# EAGLE design MicroMod_Environmental (EAGLE 9.5.1)
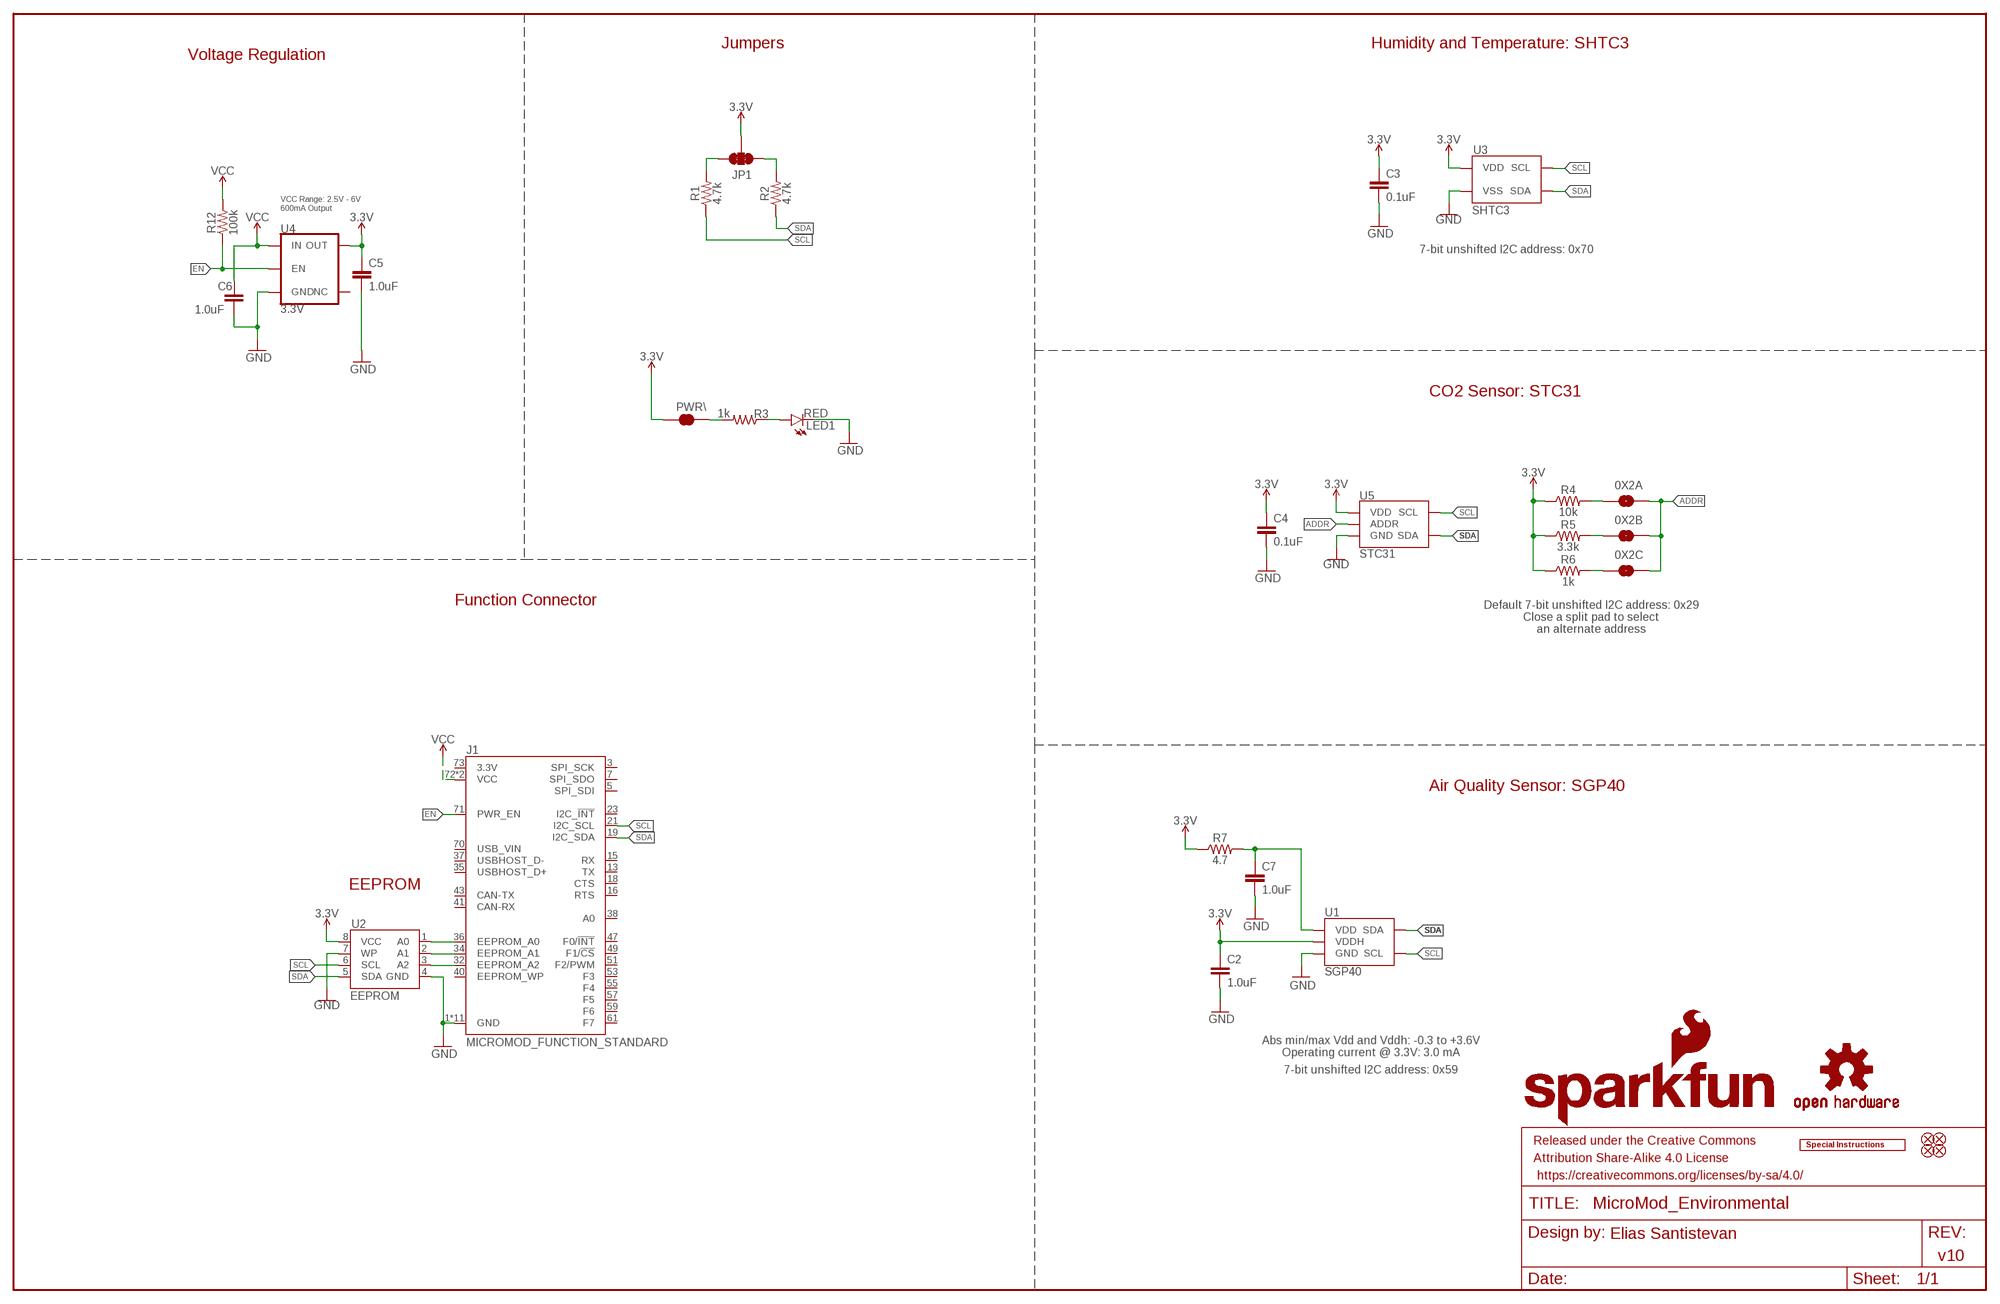
[diagram p0: schematic, sheet 1]

## Parts
0X2A  JUMPER-SMT_2_NO_SILK  [SMT-JUMPER_2_NO_SILK]
0X2B  JUMPER-SMT_2_NO_SILK  [SMT-JUMPER_2_NO_SILK]
0X2C  JUMPER-SMT_2_NO_SILK  [SMT-JUMPER_2_NO_SILK]
C2  1.0uF  1.0UF-0603-16V-10%-X7R  [0603]
C3  0.1uF  0.1UF-0603-25V-5%  [0603]
C4  0.1uF  0.1UF-0603-25V-5%  [0603]
C5  1.0uF  1.0UF-0603-16V-10%  [0603]
C6  1.0uF  1.0UF-0603-16V-10%  [0603]
C7  1.0uF  1.0UF-0603-16V-10%-X7R  [0603]
FD1  FIDUCIAL1X2  [FIDUCIAL-1X2]
FD2  FIDUCIAL1X2  [FIDUCIAL-1X2]
FD3  FIDUCIAL1X2  [FIDUCIAL-1X2]
FD4  FIDUCIAL1X2  [FIDUCIAL-1X2]
FRAME1  FRAME-LEDGER  [CREATIVE_COMMONS]
J1  MICROMOD_FUNCTION_STANDARD  [M.2-CARD-E-22_FUNCTION_STANDARD]
JP1  JUMPER-SMT_3_2-NC_TRACE_SILK  [SMT-JUMPER_3_2-NC_TRACE_SILK]
LED1  RED  LED-RED0603  [LED-0603]
LOGO1  SFE_LOGO_NAME_FLAME.2_INCH  [SFE_LOGO_NAME_FLAME_.2]
LOGO2  OSHW-LOGOS  [OSHW-LOGO-S]
LOGO3  SPECIAL_INSTRUCTIONS-ORDERING  [ORDERING_INSTRUCTIONS]
PWR\  JUMPER-SMT_2_NC_TRACE_SILK  [SMT-JUMPER_2_NC_TRACE_SILK]
R1  4.7k  4.7KOHM-0603-1/10W-1%  [0603]
R2  4.7k  4.7KOHM-0603-1/10W-1%  [0603]
R3  1k  1KOHM-0603-1/10W-1%  [0603]
R4  10k  10KOHM-0603-1/10W-1%  [0603]
R5  3.3k  3.3KOHM-0603-1/10W-1%  [0603]
R6  1k  1KOHM-0603-1/10W-1%  [0603]
R7  4.7  4.7OHM-0603-1/10W-1%  [0603]
R12  100k  100KOHM-0603-1/10W-1%  [0603]
U1  SGP40  [SGP40]
U2  EEPROM  EEPROM-I2C512K  [SO08]
U3  SHTC3  [SHTC3]
U4  3.3V  V_REG_AP2112K-3.3V  [SOT23-5]
U5  STC31  [STC31]

## Nets
3.3V [Diff pairs]: C2.1 C3.1 C4.1 C5.1 JP1.2 PWR\.2 R4.1 R5.1 R6.1 R7.1 U1.5(VDDH) U2.8(VCC) U3.1(VDD) U4.5(OUT) U5.6(VDD)
A0: J1.36(EEPROM_A0) U2.1(A0)
A1: J1.34(EEPROM_A1) U2.2(A1)
A2: J1.32(EEPROM_A2) U2.3(A2)
ADDR: 0X2A.2 0X2B.2 0X2C.2 U5.3(ADDR)
EN: J1.71(PWR_EN) R12.1 U4.3(EN)
GND: C2.2 C3.2 C4.2 C5.2 C6.2 C7.2 J1.1(GND) J1.33(GND) J1.39(GND) J1.45(GND) J1.75(GND) J1.GND1(GND) J1.GND2(GND) J1.GND3(GND) J1.GND4(GND) J1.GND5(GND) J1.GND6(GND) LED1.C U1.2(GND) U1.4(GND) U1.DIEPAD(GND) U2.4(GND) U2.7(WP) U3.4(VSS) U3.5(VSS) U4.2(GND) U5.1(GND) U5.5(GND) U5.9(GND) U5.11(GND) U5.DIEPAD(GND)
N$1: PWR\.1 R3.2
N$2: C7.1 R7.2 U1.1(VDD)
N$3: JP1.3 R1.2
N$4: JP1.1 R2.2
N$5: 0X2A.1 R4.2
N$6: 0X2B.1 R5.2
N$7: 0X2C.1 R6.2
N$10: LED1.A R3.1
SCL: J1.21(I2C_SCL) R1.1 U1.6(SCL) U2.6(SCL) U3.2(SCL) U5.4(SCL)
SDA: J1.19(I2C_SDA) R2.1 U1.3(SDA) U2.5(SDA) U3.3(SDA) U5.7(SDA)
VCC: C6.1 J1.72(VCC) J1.74(VCC) R12.2 U4.1(IN)
Unconnected: J1.3(SPI_SCK) J1.5(SPI_SDI) J1.7(SPI_SDO) J1.13(TX) J1.15(RX) J1.16(RTS) J1.18(CTS) J1.23(I2C_!INT!) J1.35(USBHOST_D+) J1.37(USBHOST_D-) J1.38(A0) J1.40(EEPROM_WP) J1.41(CAN-RX) J1.43(CAN-TX) J1.47(F0/!INT!) J1.49(F1/!CS!) J1.51(F2/PWM) J1.53(F3) J1.55(F4) J1.57(F5) J1.59(F6) J1.61(F7) J1.70(USB_VIN) J1.73(3.3V) U4.4(NC)

## Notes on the sheet
- Jumpers | Humidity and Temperature: SHTC3
- Voltage Regulation
- VCC Range: 2.5V - 6V 
  600mA Output
- 7-bit unshifted I2C address: 0x70
- CO2 Sensor: STC31
- Function Connector
- Default 7-bit unshifted I2C address: 0x29
  Close a split pad to select
  an alternate address
- Air Quality Sensor: SGP40
- EEPROM
- Abs min/max Vdd and Vddh: -0.3 to +3.6V
  Operating current @ 3.3V: 3.0 mA
- 7-bit unshifted I2C address: 0x59
- Elias Santistevan
- v10

## Library data of the parts
0X2A 0X2B 0X2C = SparkFun-Jumpers:JUMPER-SMT_2_NO: Normally open jumper This jumper has two pads in close proximity to each other. Apply solder to close the connection. Round pads are easier to solder for beginners, but are a lot larger. SparkFun Product that uses the round pads: SparkFun EL Sequencer <https://www.sparkfun.com/products/12781>
C2 C7 = SparkFun-Capacitors:1.0UF: 1µF ceramic capacitors A capacitor is a passive two-terminal electrical component used to store electrical energy temporarily in an electric field.; PROD_ID: CAP-13930
C3 C4 = SparkFun-Capacitors:0.1UF: 0.1µF ceramic capacitors A capacitor is a passive two-terminal electrical component used to store electrical energy temporarily in an electric field.; PROD_ID: CAP-08604
C5 C6 = SparkFun-Capacitors:1.0UF: 1µF ceramic capacitors A capacitor is a passive two-terminal electrical component used to store electrical energy temporarily in an electric field.; PROD_ID: CAP-00868
FD1-FD4 = SparkFun-Aesthetics:FIDUCIAL: Fiducial Alignment Points Point-of-reference for pick-and-place machines and other optical instruments.
FRAME1 = SparkFun-Aesthetics:FRAME-LEDGER: Schematic Frame - Ledger Standard 11x14 US Ledger frame
J1 = SparkFun-MicroMod:MICROMOD_FUNCTION: MicroMod Connector Description: A card edge connector and mating PCB connector to allow various MicroMod Processor Boards to be coupled with various carrier boards of different capabilities. Based on the M.2 standard.
JP1 = SparkFun-Jumpers:JUMPER-SMT_3_2-NC_TRACE: Normally closed trace jumper (2 of 2 connections) This jumper has a trace between all three pads so they are normally closed (NC). Use a razor knife to open the connection(s). For best results follow the IPC guidelines for cutting traces: Cutout at least 0.063 mm (0.005 in). Remove all loose material to clean up the cut area. Seal the cut with an approved epoxy. Reapply solder to reclose the connection(s).
LED1 = SparkFun-LED:LED-RED: Red SMD LED Used in manufacturing of most products at SparkFun Packages: 0603 - SMD 0603 package [Product Link] <http://docs.avagotech.com/docs/AV02-0551EN> 0603 SMART - SMD 0603 SMART package ( more efficient and expensive)[Product Link] <http://www.osram-os.com/Graphics/XPic2/00077099_0.pdf> 1206 - SMD1206 package [Product Link] <https://www.sparkfun.com/datasheets/DevTools/LilyPad/Q150OVS4.pdff> SparkFun Products: Pro Mini 328 -5V <https://www.sparkfun.com/products/821> RedBoard <https://www.sparkfun.com/products/12757> IOIO-OTG <https://www.sparkfun.com/products/13613>; PROD_ID: DIO-00819
LOGO1 = SparkFun-Aesthetics:SFE_LOGO_NAME_FLAME: SparkFun Font Logo w/ Flame This is the SparkFun full logo. The logo on the schematic will always be the same size; the package variant is the height of the flame part of the logo. Default layer for the logo on the board is tSilk.
LOGO2 = SparkFun-Aesthetics:OSHW-LOGO: Open-Source Hardware (OSHW) Logo This logo indicates the piece of hardware it is found on incorporates a OSHW license and/or adheres to the definition of open source hardware found here: http://freedomdefined.org/OSHW
LOGO3 = SparkFun-Aesthetics:SPECIAL_INSTRUCTIONS: Special Ordering/Production Instructions Alert Symbol for special PCB ordering instructions or unique production process warnings. Ordering Instructions Production Instructions Types of information that should be added to box: Copper weight Soldermask color Silk color PCB thickness Number of layers PCB Standard: 1.6mm FR4 1 oz copper immersion silver plating red soldermask white silkscreen Types of information that should be added to box: Special wash requirements Depaneling instructions Humidification Glue curing Default text settings: 0.07 inch 9% ratio 50% line distance
PWR\ = SparkFun-Jumpers:JUMPER-SMT_2_NC_TRACE: Normally closed trace jumper This jumper has a trace between two pads so it's normally closed (NC). Use a razor knife to open the connection. For best results follow the IPC guidelines for cutting traces: Cutout at least 0.063 mm (0.005 in). Remove all loose material to clean up the cut area. Seal the cut with an approved epoxy. Reapply solder to reclose the connection.
R1 R2 = SparkFun-Resistors:4.7KOHM: 4.7kΩ resistor A resistor is a passive two-terminal electrical component that implements electrical resistance as a circuit element. Resistors act to reduce current flow, and, at the same time, act to lower voltage levels within circuits. - Wikipedia; PROD_ID: RES-07857
R3 R6 = SparkFun-Resistors:1KOHM: 1kΩ resistor A resistor is a passive two-terminal electrical component that implements electrical resistance as a circuit element. Resistors act to reduce current flow, and, at the same time, act to lower voltage levels within circuits. - Wikipedia; PROD_ID: RES-07856
R4 = SparkFun-Resistors:10KOHM: 10kΩ resistor A resistor is a passive two-terminal electrical component that implements electrical resistance as a circuit element. Resistors act to reduce current flow, and, at the same time, act to lower voltage levels within circuits. - Wikipedia; PROD_ID: RES-00824
R5 = SparkFun-Resistors:3.3KOHM: 3.3kΩ resistor A resistor is a passive two-terminal electrical component that implements electrical resistance as a circuit element. Resistors act to reduce current flow, and, at the same time, act to lower voltage levels within circuits. - Wikipedia; PROD_ID: RES-07851
R7 = SparkFun-Resistors:4.7OHM: 4.7Ω resistor A resistor is a passive two-terminal electrical component that implements electrical resistance as a circuit element. Resistors act to reduce current flow, and, at the same time, act to lower voltage levels within circuits. - Wikipedia; PROD_ID: RES-15581
R12 = SparkFun-Resistors:100KOHM: 100kΩ resistor A resistor is a passive two-terminal electrical component that implements electrical resistance as a circuit element. Resistors act to reduce current flow, and, at the same time, act to lower voltage levels within circuits. - Wikipedia; PROD_ID: RES-07828
U1 = SparkFun-Sensors:SGP40: The SGP40 is a digital gas sensor designed for easy integration into air purifiers or demand-controlled ventilation systems.; DIGIKEY_PART: 1649-SGP40-D-R4CT-ND; PROD_ID: IC-15580
U2 = SparkFun-IC-Memory:EEPROM-I2C: I2C EEPROMs, 24LC256 and others 24LC256 Series 256 kb I2C 2 Wire (32 k x 8 Bit) 2.5 V Serial EEPROM SMD - SOIC-8 Datasheet SparkFun Products SparkFun UDB5 - PIC UAV Development Board <https://www.sparkfun.com/products/11703> (GPS-11703); PROD_ID: IC-14645
U3 = SparkFun-Sensors:SHTC3: Sensirion SHTC3 Humidity Sensor The SHTC3 is a digital humidity and temperature sensor designed especially for battery-driven high-volume consumer electronics applications.; PROD_ID: IC-14840
U4 = SparkFun-IC-Power:V_REG_AP2112: AP2112 - 600mA CMOS LDO Regulator w/ Enable The AP2112 is CMOS process low dropout linear regulator with enable function, the regulator delivers a guaranteed 600mA (min.) continuous load current. Features Output Voltage Accuracy: ±1.5% Output Current: 600mA (Min.) Foldback Short Current Protection: 50mA Enable Function to Turn ON/OFF VOUT Low Dropout Voltage (3.3V): 250mV (Typ.) @IOUT=600mA Excellent Load Regulation: 0.2%/A (Typ.) Excellent Line Regulation: 0.02%/V (Typ.) Low Quiescent Current: 55μA (Typ.) Low Standby Current: 0.01μA (Typ.) Low Output Noise: 50μVRMS PSRR: 100Hz -65dB, 1kHz -65dB OTSD Protection Stable with 1.0μF Flexible Cap: Ceramic, Tantalum and Aluminum Electrolytic Operation Temperature Range: -40°C to 85°C ESD: MM 400V, HBM 4000V; PROD_ID: VREG-12457
U5 = SparkFun-Sensors:STC31: STC31 CO2 Sensor Based on Thermal Conductivity; MANU_PART: STC31-R3; PROD_ID: IC-16076

## Net classes
1 Antenna: width 1 mm, clearance 0.3 mm

## Board
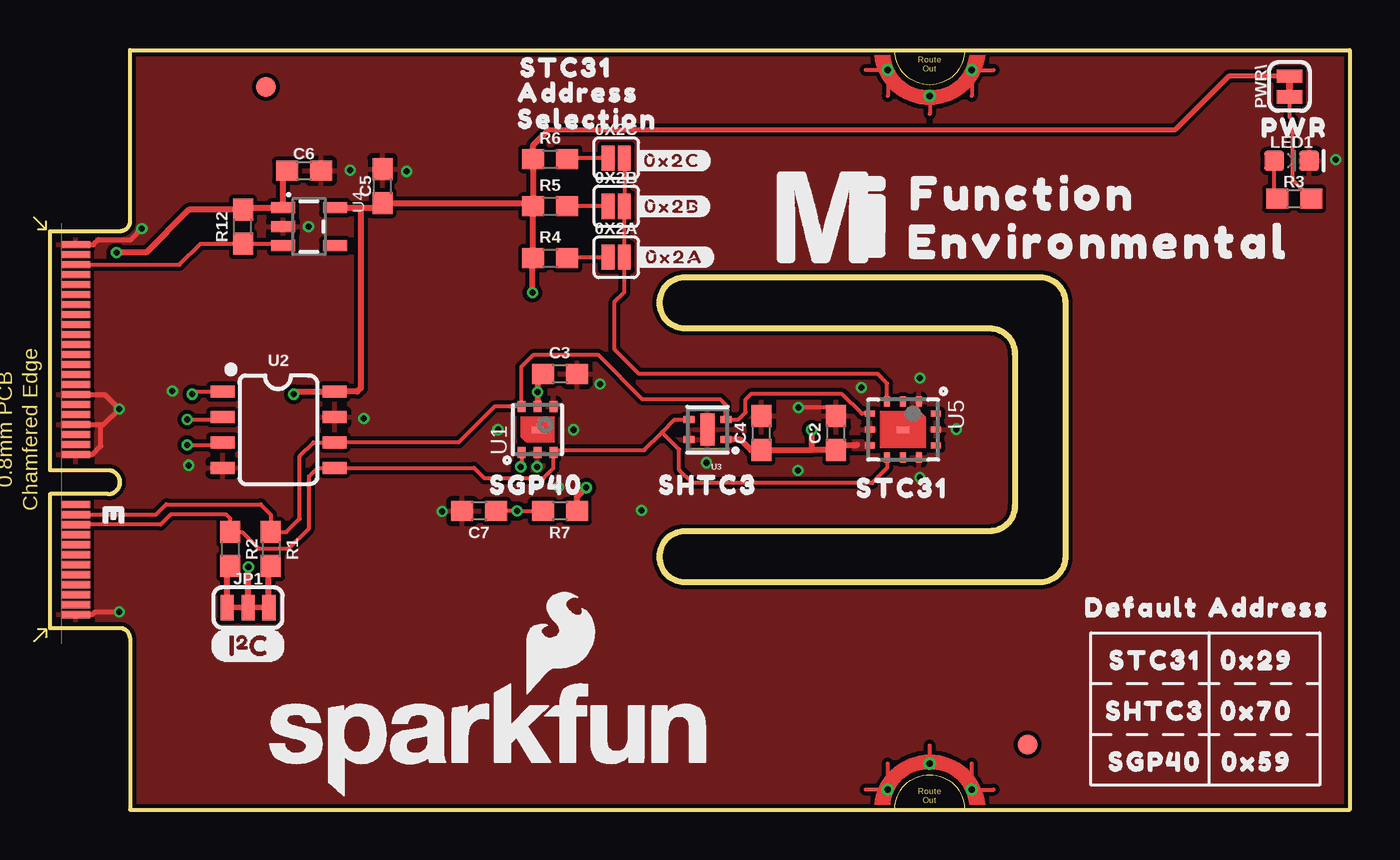
[diagram p1: board, top side]
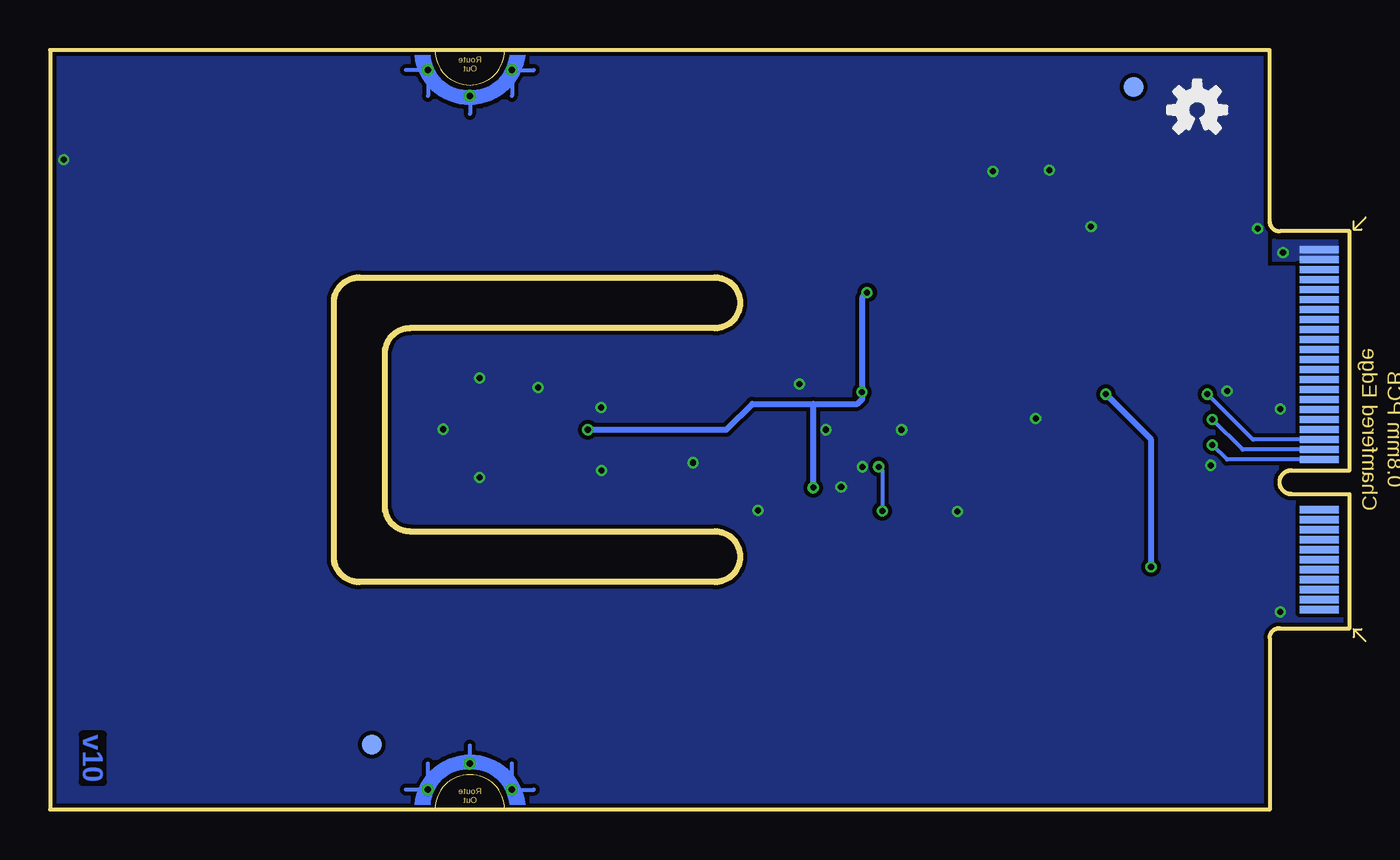
[diagram p2: board, bottom side, seen from below]

Size 65 x 38 mm. Coordinates in mm from the lower left corner, seen from the top.
Outline: 0,9.07 0,15.77 2.9,15.77 arc180 2.9,16.97 0,16.97 0,28.93 3.5,28.93 arc84 4,29.4 4,38 65,38 65,0 4,0 4,8.6 arc85 3.5,9.07 0,9.07
Outline: 30.48,12.65 arc90 31.75,11.38 49.53,11.38 arc90 50.8,12.65 50.8,25.35 arc90 49.53,26.62 31.75,26.62 arc90 30.48,25.35 arc90 31.75,24.08 46.99,24.08 arc-90 48.26,22.81 48.26,15.19 arc-90 46.99,13.92 31.75,13.92 arc90 30.48,12.65
Copper layers (1*16): Top 0.035mm / dielectric 1.5mm / Bottom 0.035mm
Design rules "SparkFun-2-Layer-Minimum-JLCPCB": minimum track width 5mil, minimum drill 0.3mm, track to track 5mil, track to pad 5mil, pad to pad 5mil, via to via 5mil, smd to smd 5mil, copper to edge 7mil, drill to drill 7mil, minimum pad ring 5mil, minimum via ring 5mil, stop-mask expansion 2.5mil, vias tented up to drill 25mil, thermal gap 10mil

### Footprints (pad centres in the part's own frame; a part is rotated, then mirrored left to right if it is on the bottom)
SMT-JUMPER_2_NO_SILK = smd 0.635 x 1.27: 1 -0.406,0; 2 0.406,0
0603 = smd 1.1 x 1: 1 -0.85,0; 2 0.85,0
FIDUCIAL-1X2 = smd 1 x 1: 1 0,0
M.2-CARD-E-22_FUNCTION_STANDARD = smd 0.35 x 1.45: 1 9.25,1.275; 3 8.75,1.275; 5 8.25,1.275; 7 7.75,1.275; 9 7.25,1.275; 11 6.75,1.275; 13 6.25,1.275; 15 5.75,1.275; 17 5.25,1.275; 19 4.75,1.275; 21 4.25,1.275; 23 3.75,1.275; 33 1.25,1.275; 35 0.75,1.275; 37 0.25,1.275; 39 -0.25,1.275; 41 -0.75,1.275; 43 -1.25,1.275; 45 -1.75,1.275; 47 -2.25,1.275; 49 -2.75,1.275; 51 -3.25,1.275; 53 -3.75,1.275; 55 -4.25,1.275; 57 -4.75,1.275; 59 -5.25,1.275; 61 -5.75,1.275; 63 -6.25,1.275; 65 -6.75,1.275; 67 -7.25,1.275; 69 -7.75,1.275; 71 -8.25,1.275; 73 -8.75,1.275; 75 -9.25,1.275 | smd 0.35 x 1.95 bottom: 2 9,1.525; 4 8.5,1.525; 6 8,1.525; 8 7.5,1.525; 10 7,1.525; 12 6.5,1.525; 14 6,1.525; 16 5.5,1.525; 18 5,1.525; 20 4.5,1.525; 22 4,1.525; 32 1.5,1.525; 34 1,1.525; 36 0.5,1.525; 38 0,1.525; 40 -0.5,1.525; 42 -1,1.525; 44 -1.5,1.525; 46 -2,1.525; 48 -2.5,1.525; 50 -3,1.525; 52 -3.5,1.525; 54 -4,1.525; 56 -4.5,1.525; 58 -5,1.525; 60 -5.5,1.525; 62 -6,1.525; 64 -6.5,1.525; 66 -7,1.525; 68 -7.5,1.525; 70 -8,1.525; 72 -8.5,1.525; 74 -9,1.525 | drill 0.305 pad 0.61: GND1 -18,41.9; GND2 -16.7,44; GND3 -18,46.1; GND4 18,41.9; GND5 16.7,44; GND6 18,46.1
SMT-JUMPER_3_2-NC_TRACE_SILK = smd 0.66 x 1.27: 1 -1.041,0; 2 0,0; 3 1.041,0
LED-0603 = smd 1 x 1: A -0.877,0; C 0.877,0
SMT-JUMPER_2_NC_TRACE_SILK = smd 0.66 x 1.27: 1 -0.521,0; 2 0.521,0
SGP40 = smd 0.55 x 0.4: 1 -1.15,0.8; 2 -1.15,0; 3 -1.15,-0.8; 4 1.15,-0.8; 5 1.15,0; 6 1.15,0.8 | smd 0.305 x 0.61: DIEPAD 0,0
SO08 = smd 0.6 x 1.2: 1 -1.905,-2.8; 2 -0.635,-2.8; 3 0.635,-2.8; 4 1.905,-2.8; 5 1.905,2.8; 6 0.635,2.8; 7 -0.635,2.8; 8 -1.905,2.8
SHTC3 = smd 0.55 x 0.35: 1 -0.925,0.5; 2 -0.925,-0.5; 3 0.925,-0.5; 4 0.925,0.5 | smd 0.7 x 1.6: 5 0,0
SOT23-5 = smd 0.55 x 1.2: 1 -0.95,-1.3; 2 0,-1.3; 3 0.95,-1.3; 4 0.95,1.3; 5 -0.95,1.3
STC31 = smd 0.5 x 0.3: 1 -1.4,0.8; 2 -1.4,0; 3 -1.4,-0.8; 7 1.4,-0.8; 8 1.4,0; 9 1.4,0.8 | smd 0.3 x 0.5: 4 -0.8,-1.65; 5 0,-1.65; 6 0.8,-1.65; 10 0.8,1.65; 11 0,1.65; 12 -0.8,1.65 | smd 0.305 x 0.61: DIEPAD 0,0

### Placement (x,y rotation side)
0X2A  28.32,27.64 0 top
0X2B  28.32,30.18 0 top
0X2C  28.32,32.59 0 top
C2  39.32,18.83 90 top
C3  25.5,21.79 0 top
C4  35.59,18.83 90 top
C5  16.64,31.19 90 top
C6  12.7,31.95 0 top
C7  21.46,14.94 180 top
FD1  10.79,36.15 0 top
FD2  10.79,36.15 0 bottom
FD3  48.9,3.25 0 bottom
FD4  48.9,3.25 0 top
FRAME1  12.7,-17.83 0 top  (outside the outline)
J1  0,19 270 top
JP1  9.91,10.11 0 top
LED1  62.1,32.46 0 top
LOGO1  21.97,3.51 0 top
LOGO2  7.62,35 0 bottom
LOGO3  80.01,50.75 0 top  (outside the outline)
PWR\  62,36.17 90 top
R1  11.05,13.03 270 top
R2  9.02,13.03 270 top
R3  62.23,30.56 0 top
R4  25.02,27.59 0 top
R5  25.02,30.18 0 top
R6  25.02,32.54 0 top
R7  25.5,14.94 180 top
R12  9.65,29.16 90 top
U1  24.38,19 90 top
U2  11.43,19 270 top
U3  32.89,19 180 top
U4  12.95,29.16 270 top
U5  42.67,19 270 top
U$1  [#0X2A#21]  31.24,27.64 0 top
U$2  [#0X2B#21]  31.11,30.18 0 top
U$3  [#0X2C#21]  31.11,32.46 0 top
U$4  [PWR321541]  62.23,34.11 0 top
U$5  [FUNCTION524]  48.64,30.81 0 top
U$6  [ENVIRONMENTAL526]  52.45,28.4 0 top
U$7  [MICROMOD_MI_LOGO_1]  39.12,29.67 0 top
U$8  [I2C]  8,8.21 0 top
U$9  [ADDRESS40313505]  26.42,35.87 0 top
U$10  [0X2940313520]  60.35,7.47 0 top
U$11  [SGP40313503]  24.33,16.23 0 top
U$12  [SHTC3501]  32.92,16.23 0 top
U$13  [STC313502]  25.81,37.11 0 top
U$14  [DEFAULT40313504]  54.61,10.11 0 top
U$15  [ADDRESS40313505]  60.96,10.11 0 top
U$16  [STC313502]  55.27,7.47 0 top
U$17  [SHTC3501]  55.27,4.93 0 top
U$18  [SGP40313503]  55.27,2.39 0 top
U$19  [0X5940313520]  60.35,2.39 0 top
U$20  [0X7040313520]  60.35,4.93 0 top
U$21  [SELECTION40313506]  26.87,34.54 0 top
U$22  [STC313502]  42.62,16.08 0 top

### Tracks (layer width: path | path; a pad name or v marks a point on that pad's centre or on a via)
3.3V  (via drill 0.3)
  Top 0.254: 24.94,34.01 56.29,34.01 58.97,36.69 PWR\.2
  Top 0.305: U4.5 15.54,30.11 | 15.54,30.11 16.41,30.11 C5.1 24,30.34 24.02,30.32 | v24.13,25.86 24.13,27.55 R4.1 R5.1 24.02,30.32 | 15.54,30.11 15.54,21.08 15.37,20.9 U2.8 12.32,20.9 v12.19,20.78 | C3.1 24.38,21.53 v24.38,20.88 U1.5 | 40.39,18.24 39.57,18.24 C2.1 38.1,17.98 | 38.1,17.98 38.1,17.97 C4.1 35.05,17.98 34.54,18.5 U3.1 | 38.1,17.98 v38.1,19 | JP1.2 9.91,12.12 v9.92,12.14 | R7.1 26.35,15.63 v26.82,16.1 | 24.94,34.01 24.17,33.24 R6.1 24.17,30.47 24.02,30.32
  Bottom 0.305: 26.82,20.29 29.87,20.29 31.17,19 v38.1,19 | 26.82,20.29 24.61,20.29 24.38,20.52 v24.38,20.88 24.38,25.6 v24.13,25.86 | v9.92,12.14 9.92,18.51 v12.19,20.78 | v26.82,16.1 26.82,20.29
  pour Top (isolate 0.305, no thermals): 41.17,18.34 40.79,18.34 40.67,18.47 40.16,18.47 40.16,17.98 40.72,17.98 40.82,18.09 41.17,18.09
A0  (via drill 0.3)
  Top 0.203: v7.11,20.78 7.24,20.9 U2.1
  Bottom 0.203: J1.36 4.83,18.5 v7.11,20.78
A1  (via drill 0.3)
  Top 0.203: v6.86,19.51 8.5,19.51 U2.2
  Bottom 0.203: J1.34 5.35,18 v6.86,19.51
A2  (via drill 0.3)
  Top 0.203: v6.86,18.24 8.5,18.24 U2.3
  Bottom 0.203: J1.32 6.12,17.5 v6.86,18.24
ADDR
  Top 0.203: 0X2C.2 0X2B.2 0X2A.2 28.73,25.88 28.25,25.4 28.25,23.01 29.46,21.79 41.4,21.79 41.87,21.32 U5.3
EN
  Top 0.203: J1.71 6.47,27.25 7.53,28.31 R12.1 11.55,28.31 U4.3
GND  (via drill 0.3)
  Top 0.203: J1.GND4 43.2,2.3 J1.GND5 44.8,2.3 J1.GND6 | J1.GND1 43.2,35.7 J1.GND2 44.03,35.73 44.93,35.73 46.1,36.9 J1.GND3 | C2.2 38.89,20.12 v37.44,20.12
  Top 0.254: J1.39 2.54,19.25 | 2.54,19.25 2.66,19.25 v3.45,20.04 2.75,20.75 J1.45 | J1.33 1.29,17.77 2.13,17.77 2.54,18.18 2.54,19.25 | J1.75 2.16,28.25 2.43,28.51 4.05,28.51 v4.6,29.06 | J1.1 1.29,9.77 2.13,9.77 2.24,9.88 v3.45,9.88
  other vias: 19.61,14.91 64.31,32.51 6.93,17.22 15.7,19.56 17.83,31.93 15.01,31.98 12.93,29.16 29.59,14.96 27.51,21.29 45.34,19.03 43.51,16.61 32.84,17.35 25.43,16.13 26.19,19 22.4,19 43.51,21.59 24.36,17.15 40.59,21.11 37.41,16.97 6.12,20.93
  pour Bottom (isolate 0.203, rank 4): 0,38.05 65.02,38.05 65.02,-0.05 0,-0.05
  pour Top (isolate 0.203, rank 4): 0,38.05 65.02,38.05 65.02,-0.05 0,-0.05
N$1
  Top 0.203: R3.2 62.15,31.48 62.15,34.49 62,34.65 PWR\.1
N$2  (via drill 0.3)
  Top 0.203: U1.1 23.58,17.18 v23.55,17.15 | R7.2 v23.37,14.94 C7.1
  Bottom 0.203: v23.55,17.15 23.37,16.97 v23.37,14.94
N$3
  Top 0.305: JP1.3 10.95,12.08 R1.2
N$4
  Top 0.305: JP1.1 8.87,12.03 R2.2
N$5
  Top 0.203: R4.2 25.92,27.64 0X2A.1
N$6
  Top 0.203: 0X2B.1 R5.2
N$7
  Top 0.203: 0X2C.1 25.92,32.59 R6.2
N$10
  Top 0.203: R3.1 61.23,30.71 LED1.A
SCL
  Top 0.203: J1.21 5.31,14.75 5.83,15.27 10.54,15.27 11.05,14.76 R1.1 11.82,13.88 12.5,14.55 12.5,17.68 13.18,18.36 U2.6 20.45,18.36 22.23,20.15 U1.6 23.58,22.15 24.19,22.76 27.41,22.76 29.64,20.52 33.53,20.52 33.78,20.27 33.78,19.54 U3.2 34.43,19.5 34.8,19.86 34.8,20.52 35.05,20.78 39.62,20.78 40.6,19.8 U5.4
SDA
  Top 0.203: J1.19 5.54,14.25 6.05,14.76 8.81,14.76 9.02,14.55 R2.1 9.6,13.88 10.43,13.05 11.94,13.05 12.95,14.07 12.95,16.66 13.39,17.09 U2.5 21.21,17.09 21.72,16.59 24.69,16.59 25.18,17.08 U1.3 25.32,17.98 29.72,17.98 30.61,18.87 | 30.61,18.87 31.23,19.5 U3.3 | U5.7 41.87,17.09 41.11,16.33 32.13,16.33 31.46,17 31.46,18.02 30.61,18.87
VCC  (via drill 0.3)
  Top 0.305: v3.33,27.86 4.8,27.86 6.95,30.01 R12.2 9.75,30.11 U4.1 11.65,31.76 C6.1
  pour Bottom (isolate 0.305, no thermals): 0.61,28.55 3.81,28.55 3.81,27.46 0.61,27.46

### Text on the board
Bottom: v10
tDocu: ENIG Finish | 0.8mm PCB | Chamfered Edge | Elias Santistevan